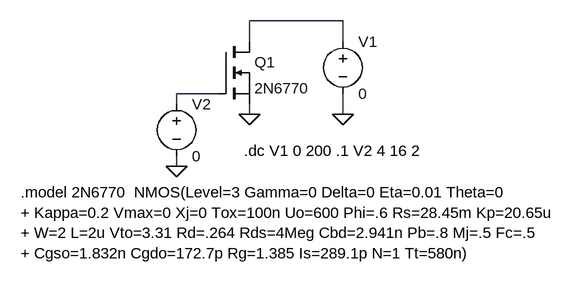
[diagram p0: schematic 2N6770.asc]
2N6770.asc, the LTspice schematic file:
Version 4
SHEET 1 1832 680
WIRE 368 -128 224 -128
WIRE 224 -96 224 -128
WIRE 368 -96 368 -128
WIRE 176 -16 112 -16
WIRE 112 0 112 -16
WIRE 224 16 224 0
WIRE 368 16 368 -16
WIRE 112 96 112 80
FLAG 368 16 0
FLAG 224 16 0
FLAG 112 96 0
SYMBOL voltage 368 -112 R0
SYMATTR InstName V1
SYMATTR Value 0
SYMBOL voltage 112 -16 R0
SYMATTR InstName V2
SYMATTR Value 0
SYMBOL nmos 176 -96 R0
SYMATTR InstName Q1
SYMATTR Value 2N6770
TEXT 216 72 Left 0 !.dc V1 0 200 .1 V2 4 16 2
TEXT -128 136 Left 0 !.model 2N6770  NMOS(Level=3 Gamma=0 Delta=0 Eta=0.01 Theta=0\n+ Kappa=0.2 Vmax=0 Xj=0 Tox=100n Uo=600 Phi=.6 Rs=28.45m Kp=20.65u\n+ W=2 L=2u Vto=3.31 Rd=.264 Rds=4Meg Cbd=2.941n Pb=.8 Mj=.5 Fc=.5\n+ Cgso=1.832n Cgdo=172.7p Rg=1.385 Is=289.1p N=1 Tt=580n)

The netlist it stands for:
* 2N6770.asc
V1 N001 0 0
V2 N002 0 0
M§Q1 N001 N002 0 0 2N6770
.model NMOS NMOS
.model PMOS PMOS
.lib standard.mos
.dc V1 0 200 .1 V2 4 16 2
.model 2N6770  NMOS(Level=3 Gamma=0 Delta=0 Eta=0.01 Theta=0
+ Kappa=0.2 Vmax=0 Xj=0 Tox=100n Uo=600 Phi=.6 Rs=28.45m Kp=20.65u
+ W=2 L=2u Vto=3.31 Rd=.264 Rds=4Meg Cbd=2.941n Pb=.8 Mj=.5 Fc=.5
+ Cgso=1.832n Cgdo=172.7p Rg=1.385 Is=289.1p N=1 Tt=580n)
.backanno
.end